# Altium schematic sheet Sheet4_Audio_In.SchDoc: JJGEEX_Homie_POC1
size Legal; Author: Jonas Cooper; CompanyName: JJ-GEEX; DrawnBy: Jonas Cooper; Organization: Homie Secure Smarthome; Address1: -; Address2: CU Boulder ECEE; Address3: -; Address4: Capstone; DocumentNumber: 1; Revision: 1; SheetNumber: 4; SheetTotal: 4; ImagePath: C:\Users\Rizla\Documents\GitHub\Capstone\Hardware\Altium\POCboard_JJGEEX\Logo.jpg
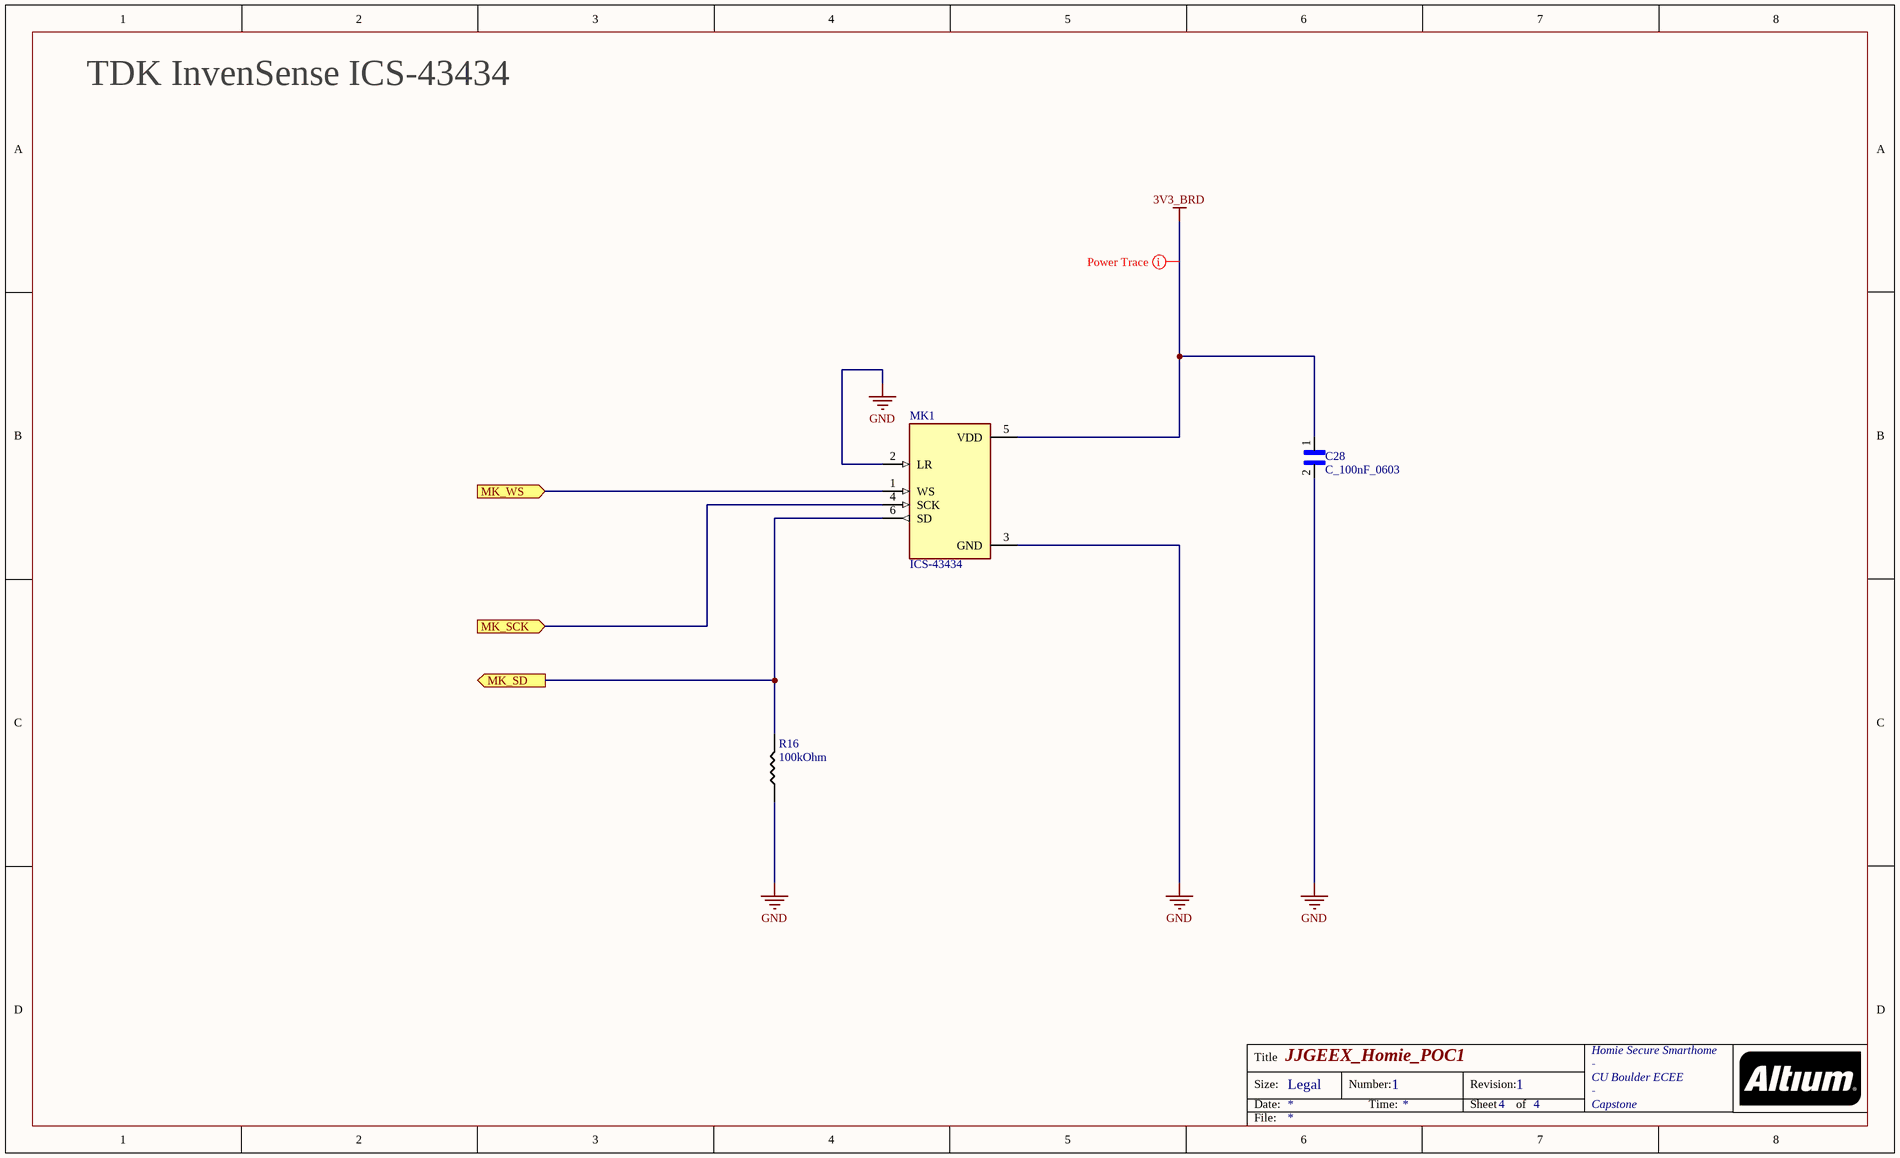
[diagram p0: Sheet4_Audio_In.SchDoc]

## Parts
C28  C_100nF_0603  [CAPC1608X90]
MK1  ICS-43434  [MIC_ICS-43434]
R16  value 100kOhm  [R0603]  (hidden comment: 100 kOhm)

## Ports
MK_SCK (in), MK_SD (out), MK_WS (in)

## Nets
3V3_BRD: C28.1 MK1.5(VDD)
GND: C28.2 MK1.2(LR) MK1.3(GND) R16.1
MK_SCK: MK1.4(SCK) ; port MK_SCK
MK_SD: MK1.6(SD) R16.2 ; port MK_SD
MK_WS: MK1.1(WS) ; port MK_WS

## Layout directives
rule Width Constraint [Pref Width = 13mil    Min Width = 6mil    Max Width = 100mil]: 3V3_BRD

## Notes on the sheet
- TDK InvenSense ICS-43434
- Title
- Size:
- Date:
- Legal
- Number:
- Time:
- Revision:
- Sheet
- of
- File:

## Library data of the parts
C28 = C_100nF_0603: 0.1µF/100nF  Â±10% 50V Ceramic Capacitor X7R 0603 _1608 Metric_; MP: CC0603KRX7R9BB104; MF: Yageo; Digi-Key_Purchase_URL: https://www.digikey.com/product-detail/en/yageo/CC0603KRX7R9BB104/311-1344-1-ND/2103128?utm_source=snapeda&utm_medium=aggregator&utm_campaign=symbol; Digi-Key_Part_Number: 311-1344-1-ND; Package: 0603 Yageo; LCSC#: C14663; SnapEDA Link: https://www.snapeda.com/parts/CC0603KRX7R9BB104/Yageo/view-part/78680/?ref=snap
MK1 = ICS-43434: 60Hz ~ 20kHz Digital, IÂ²S Microphone MEMS _Silicon_ 1.65V ~ 3.63V Omnidirectional _-26 Â±1dB @ 94dB SPL_ Solder Pads; MF: TDK InvenSense; Value: *; MP: ICS-43434; Package: TDK InvenSense; Price: None; Availability: Unavailable; SnapEDA_Link: https://www.snapeda.com/parts/ICS-43434/TDK%20InvenSense/view-part/4478548/?ref=snap
R16 = R_100kOhm_0603: 100kOhm +-1%; MFR: Uniroyal; Mfr#: 0603WAF1003T5E; LCSC#: C25803